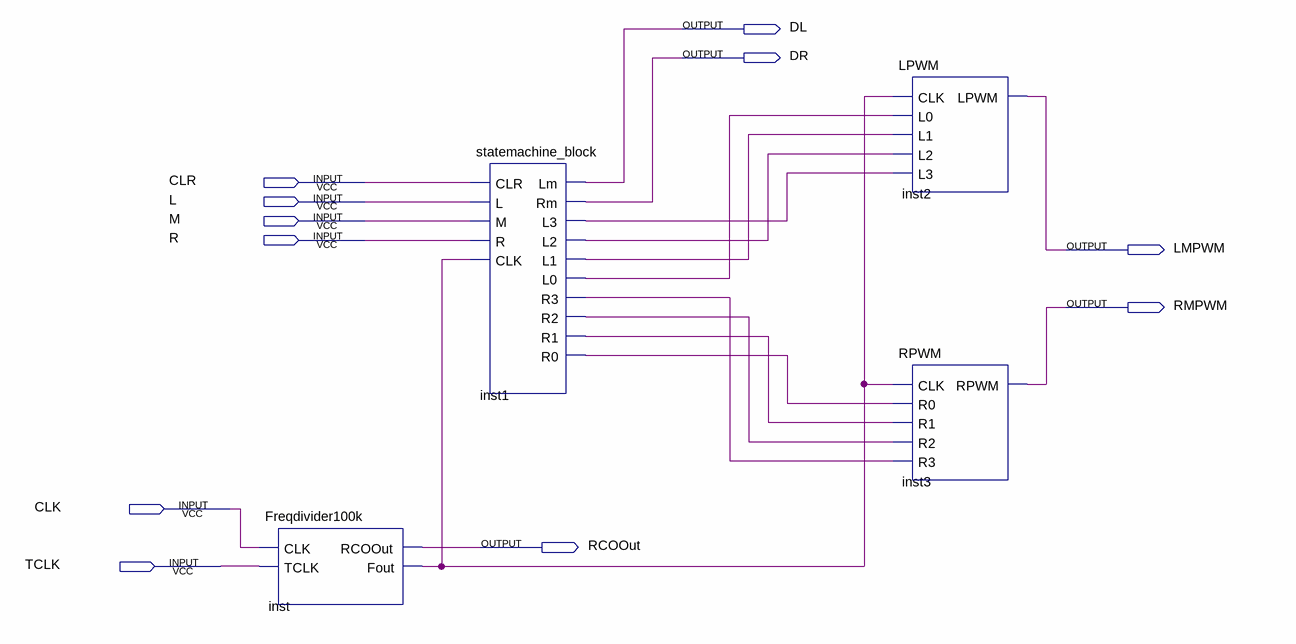
[diagram p0: schematic sheet]
// Quartus schematic Final_Schematic.bdf as structural Verilog: 4 symbols, 11 pins
module Final_Schematic (
  input  CLR,
  input  L,
  input  M,
  input  R,
  input  CLK,
  input  TCLK,
  output DL,
  output DR,
  output LMPWM,
  output RMPWM,
  output RCOOut
);

  wire inst1_l0, inst1_l1, inst1_l2, inst1_l3, inst1_r0, inst1_r1, inst1_r2, inst1_r3, inst_fout;

  Freqdivider100k inst (.CLK(CLK), .TCLK(TCLK), .RCOOut(RCOOut), .Fout(inst_fout));
  statemachine_block inst1 (
    .CLR(CLR), .L(L), .M(M), .R(R), .CLK(inst_fout), .Lm(DL), .Rm(DR), .L3(inst1_l3), .L2(inst1_l2),
    .L1(inst1_l1), .L0(inst1_l0), .R3(inst1_r3), .R2(inst1_r2), .R1(inst1_r1), .R0(inst1_r0));
  LPWM inst2 (.CLK(inst_fout), .L0(inst1_l0), .L1(inst1_l1), .L2(inst1_l2), .L3(inst1_l3), .LPWM(LMPWM));
  RPWM inst3 (.CLK(inst_fout), .R0(inst1_r0), .R1(inst1_r1), .R2(inst1_r2), .R3(inst1_r3), .RPWM(RMPWM));
endmodule
